# Altium project PCBSmartControlProject.PrjPCB
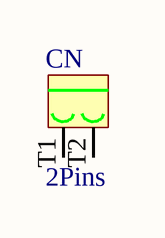
[diagram p0: Sheet1.SchDoc]
1 sheet, 1 parts. Net scope: global (net labels, ports and power ports of the same name join across sheets).
Board file: PCB1.PcbDoc

## Sheet Sheet1.SchDoc
size A

### Parts
CN  2Pins  [2Pins_terminal blocks_H]

### Nets

Not connected (* = marked no-connect by the designer): CN T1 T2

### Library data of the parts
CN = 2Pins_pluggable terminal blocks